# Altium schematic sheet 13-UsbToTTL.SchDoc
size A4
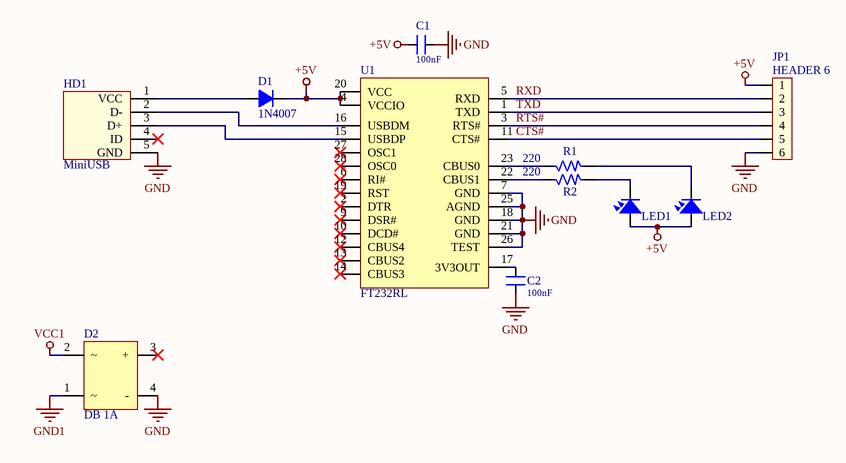
[diagram p0: 13-UsbToTTL.SchDoc]

## Parts
C1  100nF  [C-0805]
C2  100nF  [C-0805]
D1  1N4007  [D-DO214-AC]
D2  DB 1A  [D-DB-1A-SMD]
HD1  MiniUSB  [USB-MicroUSB-SMD]
JP1  HEADER 6  [JP6]
LED1  LED  [LED-0805]  (value not drawn)
LED2  LED  [LED-0805]  (value not drawn)
R1  220  [RES-0805]
R2  220  [RES-0805]
U1  FT232RL  [SSOP-28]

## Nets
+5V: C1.2 D1.2(K) JP1.1 LED1.1 LED2.1 U1.4(VCCIO) U1.20(VCC)
GND: C1.1 C2.1 D2.4(-) HD1.5(GND) HD1.HM1(GND) HD1.HM2(GND) JP1.6 U1.7(GND) U1.18(GND) U1.21(GND) U1.25(AGND) U1.26(TEST)
GND1: D2.1
VCC1: D2.2
CTS#: JP1.5 U1.11(CTS#)
RTS#: JP1.4 U1.3(RTS#)
RXD: JP1.2 U1.5(RXD)
TXD: JP1.3 U1.1(TXD)
NetC2_2: C2.2 U1.17(3V3OUT)
NetD1_1: D1.1(A) HD1.1(VCC)
NetHD1_2: HD1.2(D-) U1.16(USBDM)
NetHD1_3: HD1.3(D+) U1.15(USBDP)
NetLED1_2: LED1.2 R2.2
NetLED2_2: LED2.2 R1.2
NetR1_1: R1.1 U1.23(CBUS0)
NetR2_1: R2.1 U1.22(CBUS1)

Not connected (* = marked no-connect by the designer): D2 3(+)*; HD1 4(ID)*; U1 2(DTR)* 6(RI#)* 8(NC) 9(DSR#)* 10(DCD#)* 12(CBUS4)* 13(CBUS2)* 14(CBUS3)* 19(RST)* 24(NC) 27(OSC1)* 28(OSC0)*

## Library data of the parts
C1 C2 = Ceramic
D1 = Diode
D2 = DB
HD1 = MicroUsB: Value: MicorUSB
JP1 = JP6: JP6 PIN; Value: JP7
LED1 LED2 = LED SMD: Value: LED 3 - 5 ly 2 Colour
R1 R2 = Res1/4W